# EAGLE design Pinguino-PIC18F2550 (EAGLE 7.2.0)
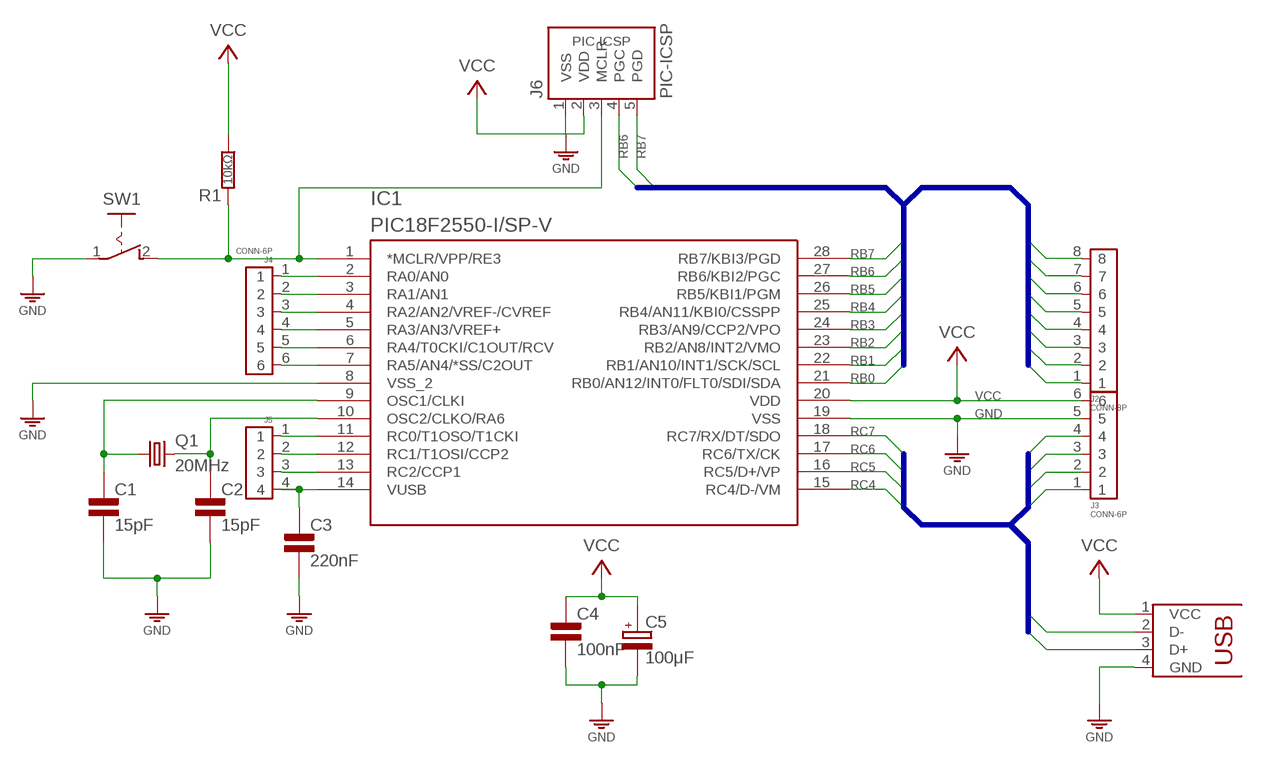
[diagram p0: schematic, sheet 1]

## Parts
C1  15pF  C025-015X024  [C025-015X024]
C2  15pF  C025-015X024  [C025-015X024]
C3  220nF  C075-032X103  [C075-032X103]
C4  100nF  C025-015X024  [C025-015X024]
C5  100μF  CPOLE2,5-4  [E2,5-4]
IC1  PIC18F2550-I/SP-V  [DIL28-3/V]
J1  USB-PRINT  [USB-B-PRINT]
J2  CONN-8P  [CONN-8P]
J3  CONN-6P  [CONN-6P]
J4  CONN-6P  [CONN-6P]
J5  CONN-4P-4P  [CONN-4P]
J6  PIC-ICSP  [CONN-5P]
J8  VCC_GNDPWR-R  [PWR-R]
Q1  20MHz  CRYSTALHC49  [HC49]
R1  10kΩ  R0204/10  [0204/10]
SW1  PB-1P-1T  [PB-1P1T]

## Nets
/MCLR: IC1.1(*MCLR/VPP/RE3) J6.3(MCLR) R1.2 SW1.2(S)
GND: C1.2 C2.2 C3.2 C4.2 C5.- IC1.8(VSS_2) IC1.19(VSS) J1.4(GND) J3.5 J6.1(VSS) J8.1 SW1.1(P)
N$2: C2.1 IC1.10(OSC2/CLKO/RA6) Q1.2
N$3: C1.1 IC1.9(OSC1/CLKI) Q1.1
N$5: C3.1 IC1.14(VUSB) J5.4
N$17: IC1.3(RA1/AN1) J4.2
N$18: IC1.2(RA0/AN0) J4.1
N$19: IC1.4(RA2/AN2/VREF-/CVREF) J4.3
N$20: IC1.5(RA3/AN3/VREF+) J4.4
N$21: IC1.6(RA4/T0CKI/C1OUT/RCV) J4.5
N$22: IC1.7(RA5/AN4/*SS/C2OUT) J4.6
N$23: IC1.12(RC1/T1OSI/CCP2) J5.2
N$24: IC1.11(RC0/T1OSO/T1CKI) J5.1
N$25: IC1.13(RC2/CCP1) J5.3
RB0: IC1.21(RB0/AN12/INT0/FLT0/SDI/SDA) J2.1
RB1: IC1.22(RB1/AN10/INT1/SCK/SCL) J2.2
RB2: IC1.23(RB2/AN8/INT2/VMO) J2.3
RB3: IC1.24(RB3/AN9/CCP2/VPO) J2.4
RB4: IC1.25(RB4/AN11/KBI0/CSSPP) J2.5
RB5: IC1.26(RB5/KBI1/PGM) J2.6
RB6: IC1.27(RB6/KBI2/PGC) J2.7 J6.4(PGC)
RB7: IC1.28(RB7/KBI3/PGD) J2.8 J6.5(PGD)
RC4: IC1.15(RC4/D-/VM) J1.3(D+) J3.1
RC5: IC1.16(RC5/D+/VP) J1.2(D-) J3.2
RC6: IC1.17(RC6/TX/CK) J3.3
RC7: IC1.18(RC7/RX/DT/SDO) J3.4
VCC: C4.1 C5.+ IC1.20(VDD) J1.1(VCC) J3.6 J6.2(VDD) J8.2 R1.1

## Buses
RB[0..7]
RC[4..7],VSS,VDD

## Library data of the parts
C1-C4 = c:C: CAPACITOR, European symbol
C5 = c:CPOL: POLARIZED CAPACITOR, European symbol
IC1 = mcu:PIC18F2550-I/SP
J1 = usb:USB: USB Connectors USB-B-PTH is fully proven SKU : PRT-00139 USB-miniB is fully proven SKU : PRT-00587 USB-A-PCB is untested. USB-A-H is throughly reviewed, but untested. Spark Fun Electronics SKU : PRT-00437 USB-B-SMT is throughly reviewed, but untested. Needs silkscreen touching up. USB-A-S has not been used/tested USB-MB-H has not been used/tested
J2 = pinconn:CONN-8P
J3 J4 = pinconn:CONN-6P
J5 = pinconn:CONN-4P
J6 = pinconn:PIC-ICSP
J8 = pad:VCC_GND
Q1 = q:CRYSTAL
R1 = r:R: RESISTOR, European symbol
SW1 = sw:PB-1P-1T

## Net classes
0 default: width 0.61 mm

## Board
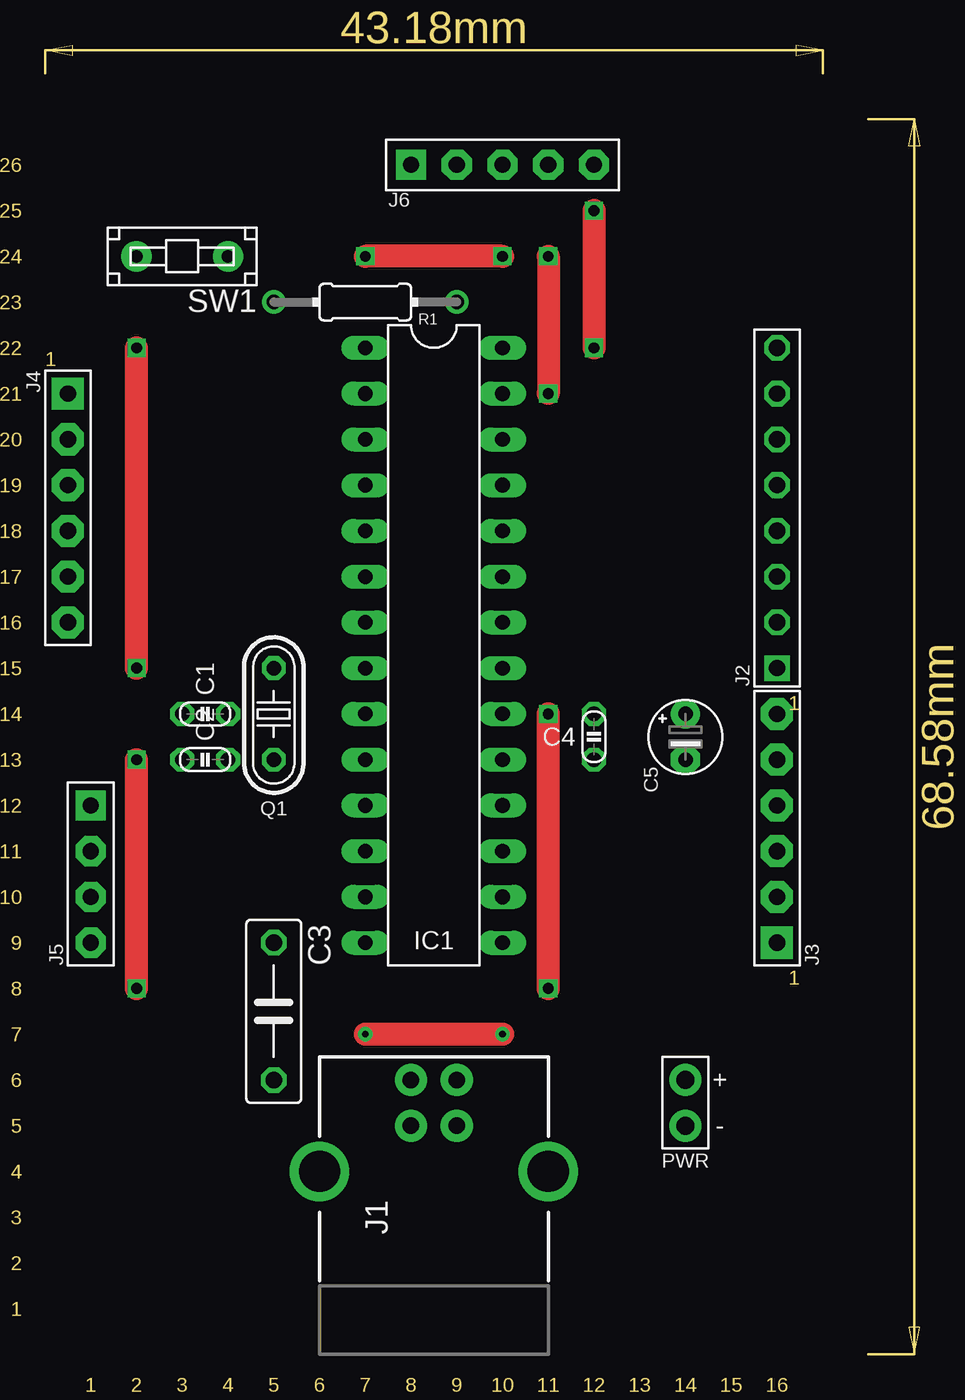
[diagram p1: board, top side]
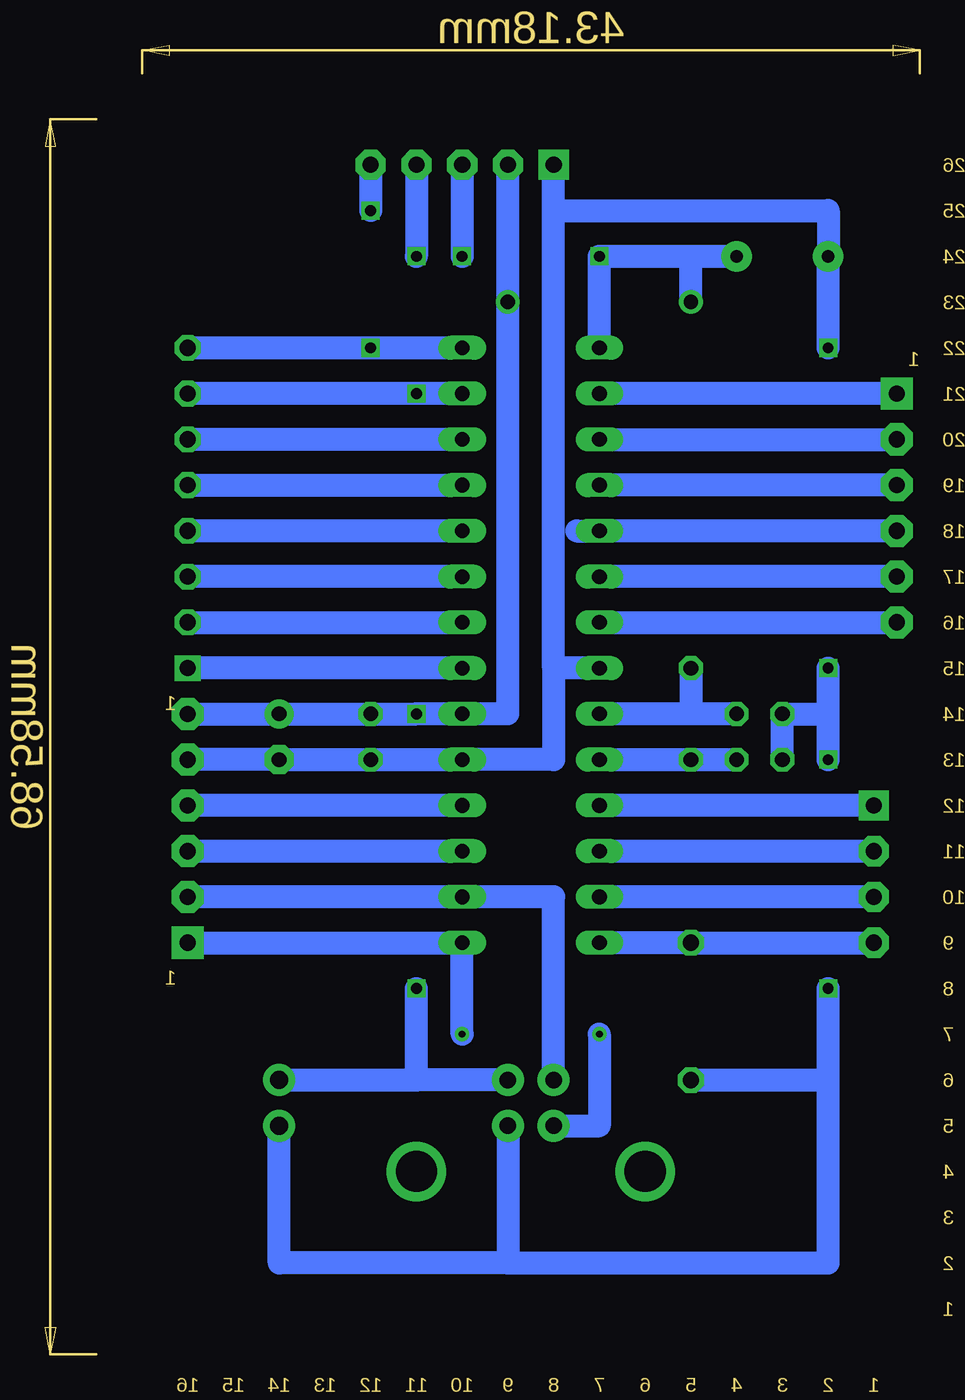
[diagram p2: board, bottom side, seen from below]

Size 48.56 x 72.69 mm. Coordinates in mm from the lower left corner, seen from the top.
Copper layers (1*16): Top 0.035mm / dielectric 1.5mm / Bottom 0.035mm
Design rules "default": minimum track width 10mil, minimum drill 24mil, track to track 8mil, track to pad 8mil, pad to pad 8mil, via to via 8mil, smd to smd 8mil, copper to edge 40mil, drill to drill 8mil, minimum pad ring 10mil, minimum via ring 8mil, stop-mask expansion 4mil, vias tented up to drill 0mil, thermal gap 10mil

### Footprints (pad centres in the part's own frame; a part is rotated, then mirrored left to right if it is on the bottom)
C025-015X024 = drill 0.813 octagon: 1 0,1.27; 2 0,-1.27
C075-032X103 = drill 0.914 octagon: 1 -3.81,0; 2 3.81,0
E2,5-4 = drill 0.813 pad 1.6: + 2.54,0 | drill 0.813 pad 1.6 octagon: - 0,0
DIL28-3/V = drill 0.813 long: 1 -3.81,16.51; 2 -3.81,13.97; 3 -3.81,11.43; 4 -3.81,8.89; 5 -3.81,6.35; 6 -3.81,3.81; 7 -3.81,1.27; 8 -3.81,-1.27; 9 -3.81,-3.81; 10 -3.81,-6.35; 11 -3.81,-8.89; 12 -3.81,-11.43; 13 -3.81,-13.97; 14 -3.81,-16.51; 15 3.81,-16.51; 16 3.81,-13.97; 17 3.81,-11.43; 18 3.81,-8.89; 19 3.81,-6.35; 20 3.81,-3.81; 21 3.81,-1.27; 22 3.81,1.27; 23 3.81,3.81; 24 3.81,6.35; 25 3.81,8.89; 26 3.81,11.43; 27 3.81,13.97; 28 3.81,16.51
USB-B-PRINT = drill 0.914 pad 1.778: 1 0,6.35; 2 -2.54,6.35; 3 -2.54,3.81; 4 0,3.81 | drill 2.286: P$1 5.08,1.27; P$2 -7.62,1.27
CONN-8P = drill 0.9 pad 1.422 square: 1 0,0 | drill 0.9 pad 1.422 octagon: 2 2.54,0; 3 5.08,0; 4 7.62,0; 5 10.16,0; 6 12.7,0; 7 15.24,0; 8 17.78,0
CONN-6P = drill 0.9 pad 1.778 square: 1 -6.35,0 | drill 0.9 pad 1.778 octagon: 2 -3.81,0; 3 -1.27,0; 4 1.27,0; 5 3.81,0; 6 6.35,0
CONN-4P = drill 0.9 pad 1.676 square: 1 -3.81,0 | drill 0.9 pad 1.676 octagon: 2 -1.27,0; 3 1.27,0; 4 3.81,0
CONN-5P = drill 0.9 pad 1.676 square: 1 0,0 | drill 0.9 pad 1.676 octagon: 2 2.54,0; 3 5.08,0; 4 7.62,0; 5 10.16,0
PWR-R = drill 1 pad 1.778: 1 0,-1.27; 2 0,1.27
HC49 = drill 0.813 octagon: 1 0,-2.54; 2 0,2.54
0204/10 = drill 0.8: 1 -5.08,0; 2 5.08,0
PB-1P1T = drill 0.7 pad 1.676: 1 2.54,0; 2 -2.54,0

### Placement (x,y rotation side)
C1  8.89,35.56 270 top
C2  8.89,33.02 270 top
C3  12.7,19.05 270 top
C4  30.48,34.29 0 top
C5  35.56,33.02 90 top
IC1  21.59,39.37 0 top
J1  22.86,8.89 0 top
J2  40.64,38.1 90 top
J3  40.64,29.21 90 top
J4  1.27,46.99 270 top
J5  2.54,26.67 270 top
J6  20.32,66.04 0 top
J8  35.56,13.97 0 top
Q1  12.7,35.56 180 top
R1  17.78,58.42 180 top
SW1  7.62,60.96 180 top

### Tracks (layer width: path | path; a pad name or v marks a point on that pad's centre or on a via)
/MCLR  (via drill 0.6)
  Top 1.27: v25.4,60.96 v17.78,60.96
  Bottom 1.27: J6.3 v25.4,60.96 | IC1.1 v17.78,60.96 12.7,60.96 | 12.7,60.96 SW1.2 | R1.2 12.7,60.96
GND  (via drill 0.6)
  Top 1.27: v5.08,20.32 v5.08,33.02 | v5.08,38.1 v5.08,55.88
  Bottom 1.27: 20.32,38.1 20.32,33.02 IC1.19 C4.2 C5.- J3.5 | IC1.8 20.32,38.1 | 20.32,38.1 20.32,63.5 | 20.32,63.5 5.08,63.5 SW1.1 v5.08,55.88 | 22.86,5.08 5.08,5.08 5.08,15.24 | 5.08,15.24 v5.08,20.32 | v5.08,33.02 5.08,35.56 | 5.08,35.56 v5.08,38.1 | 20.32,63.5 J6.1 | J1.4 22.86,5.08 | 22.86,5.08 35.56,5.08 J8.1 | C3.2 5.08,15.24 | C2.2 C1.2 5.08,35.56
N$2
  Bottom 1.27: IC1.10 Q1.2 C2.1
N$3
  Bottom 1.27: C1.1 12.7,35.56 | Q1.1 12.7,35.56 | 12.7,35.56 IC1.9
N$5
  Bottom 1.27: IC1.14 C3.1 J5.4
N$17
  Bottom 1.27: IC1.3 J4.2
N$18
  Bottom 1.27: J4.1 IC1.2
N$19
  Bottom 1.27: J4.3 IC1.4
N$20
  Bottom 1.27: J4.4 IC1.5 19.05,45.72
N$21
  Bottom 1.27: J4.5 IC1.6
N$22
  Bottom 1.27: IC1.7 J4.6
N$23
  Bottom 1.27: IC1.12 J5.2
N$24
  Bottom 1.27: J5.1 IC1.11
N$25
  Bottom 1.27: J5.3 IC1.13
RB0
  Bottom 1.27: IC1.21 J2.1
RB1
  Bottom 1.27: J2.2 IC1.22
RB2
  Bottom 1.27: IC1.23 J2.3
RB3
  Bottom 1.27: IC1.24 J2.4
RB4
  Bottom 1.27: J2.5 IC1.25
RB5
  Bottom 1.27: IC1.26 J2.6
RB6  (via drill 0.6)
  Top 1.27: v27.94,60.96 v27.94,53.34
  Bottom 1.27: J6.4 v27.94,60.96 | IC1.27 v27.94,53.34 J2.7
RB7  (via drill 0.6)
  Top 1.27: v30.48,63.5 v30.48,55.88
  Bottom 1.27: J6.5 v30.48,63.5 | J2.8 v30.48,55.88 IC1.28
RC4  (via drill 0.38)
  Top 1.27: v25.4,17.78 v17.78,17.78
  Bottom 1.27: J3.1 IC1.15 v25.4,17.78 | J1.3 17.78,12.7 v17.78,17.78
RC5
  Bottom 1.27: J3.2 IC1.16 20.32,25.4 J1.2
RC6
  Bottom 1.27: J3.3 IC1.17
RC7
  Bottom 1.27: IC1.18 J3.4
VCC  (via drill 0.6)
  Top 1.27: v27.94,20.32 v27.94,35.56
  Bottom 1.27: J3.6 C5.+ C4.1 v27.94,35.56 IC1.20 22.86,35.56 R1.1 J6.2 | 27.94,15.24 v27.94,20.32 | J1.1 27.94,15.24 | J8.2 27.94,15.24

### Text on the board
Dimension: 26 | 25 | 24 | 23 | 22 | 21 | 20 | 19 | 18 | 17 | 16 | 15 | 14 | 13 | 12 | 11 | 10 | 9 | 8 | 7 | 6 | 5 | 4 | 3 | 2 | 1 | 1 | 2 | 3 | 4 | 5 | 6 | 7 | 8 | 9 | 10 | 11 | 12 | 13 | 14 | 15 | 16